# Altium schematic sheet Reconstruction_Filter.SchDoc
size B; Organization: Mechanart, LLC; Address1: 397 Laurie Meadows Drive; Address2: Apt. 437; Address3: San Mateo, CA 94403
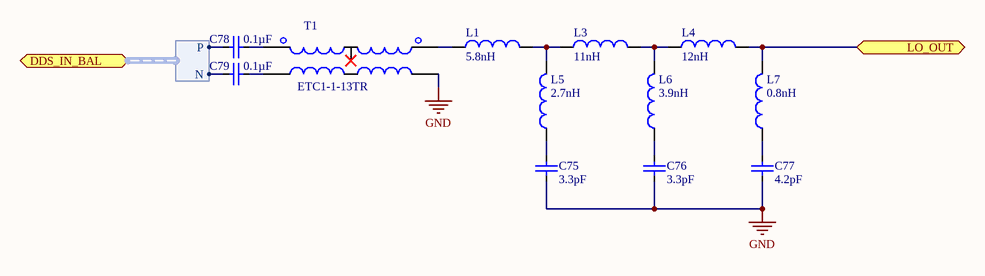
[diagram p0: Reconstruction_Filter.SchDoc]

## Parts
C75  3.3pF  [CAPC1005X50L25N]
C76  3.3pF  [CAPC1005X50L25N]
C77  4.2pF  [CAPC1005X50L25N]
C78  0.1µF  [CAPC1005X50L25N]
C79  0.1µF  [CAPC1005X50L25N]
L1  5.8nH  [INDC1006X18L23N]
L3  11nH  [INDC1006X18L23N]
L4  12nH  [INDC1006X18L23N]
L5  2.7nH  [INDC1006X18L23N]
L6  3.9nH  [INDC1006X18L23N]
L7  0.8nH  [INDC1006X18L23N]
T1  ETC1-1-13TR  [AT1521]

## Ports
DDS_IN_BAL (harness RF_BAL), LO_OUT

## Harnesses
RF_BAL: N, P

## Nets
GND: C75.2 C76.2 C77.2 T1.3(SECONDARY)
LO_OUT: L4.2 L7.2 ; port LO_OUT
NetC75_1: C75.1 L5.1
NetC76_1: C76.1 L6.1
NetC77_1: C77.1 L7.1
NetC78_1: C78.1 ; port DDS_IN_BAL.P
NetC78_2: C78.2 T1.6(PRIMARY_DOT)
NetC79_1: C79.1 ; port DDS_IN_BAL.N
NetC79_2: C79.2 T1.4(PRIMARY)
NetL1_1: L1.1 T1.1(SECONDARY_DOT)
NetL1_2: L1.2 L3.1 L5.2
NetL3_2: L3.2 L4.1 L6.2

Not connected (* = marked no-connect by the designer): T1 2(NO_CONNECT)*

## Notes on the sheet
- Title
- Size:
- Date:
- B
- Number:
- Time:
- Revision:
- Sheet
- of
- File:

## Library data of the parts
C75 C76 = GJM1555C1H3R3WB01D: CAP CER 3.3PF 50V NP0 0402; Manufacturer: Murata Electronics North America; Tolerance: ±0.05pF; Temperature Coefficient: C0G, NP0; Design Item Id: GJM1555C1H3R3WB01D; Supplier 1: Digi-Key; Supplier Part Number 1: 490-11212-1-ND; Manufacturer Part Number: GJM1555C1H3R3WB01D; RoHS: RoHS Compliant; Category: Capacitors; Stock 1: 7940; Pricing 1: 1=0.26, 10=0.216, 50=0.1216, 100=0.108, 250=0.081, 500=0.07156, 1000=0.06345, 5000=0.05265 (USD); Packaging: Cut Tape (CT); Applications: RF, Microwave, High Frequency; Operating Temperature: -55°C ~ 125°C; Mounting Type: Surface Mount, MLCC; Package / Case: 0402 (1005 Metric); ComponentLink1URL: http://www.murata.com/~/media/webrenewal/support/library/catalog/products/capacitor/mlcc/c02e.pdf; ComponentLink1Description: http://www.murata.com/~/media/webrenewal/support/library/catalog/products/capacitor/mlcc/c02e.pdf; Capacitance: 3.3pF; Voltage - Rated: 50V; Ratings: -; Size / Dimension: 0.039" L x 0.020" W (1.00mm x 0.50mm); Height - Seated (Max): -; Thickness (Max): 0.022" (0.55mm); Lead Spacing: -; Features: High Q, Low Loss; Lead Style: -
C77 = GJM1555C1H4R2BB01D: CAP CER 4.2PF 50V NP0 0402; Manufacturer: Murata Electronics North America; Tolerance: ±0.1pF; Temperature Coefficient: C0G, NP0; Design Item Id: GJM1555C1H4R2BB01D; Supplier 1: Digi-Key; Supplier Part Number 1: 490-11218-1-ND; Manufacturer Part Number: GJM1555C1H4R2BB01D; RoHS: RoHS Compliant; Category: Capacitors; Stock 1: 7288; Pricing 1: 1=0.2, 10=0.137, 50=0.0788, 100=0.0651, 250=0.0548, 500=0.0459, 1000=0.03768, 5000=0.03185 (USD); Packaging: Cut Tape (CT); Applications: RF, Microwave, High Frequency; Operating Temperature: -55°C ~ 125°C; Mounting Type: Surface Mount, MLCC; Package / Case: 0402 (1005 Metric); ComponentLink1URL: http://www.murata.com/~/media/webrenewal/support/library/catalog/products/capacitor/mlcc/c02e.pdf; ComponentLink1Description: http://www.murata.com/~/media/webrenewal/support/library/catalog/products/capacitor/mlcc/c02e.pdf; Capacitance: 4.2pF; Voltage - Rated: 50V; Ratings: -; Size / Dimension: 0.039" L x 0.020" W (1.00mm x 0.50mm); Height - Seated (Max): -; Thickness (Max): 0.022" (0.55mm); Lead Spacing: -; Features: High Q, Low Loss; Lead Style: -
C78 C79 = GRM155R71H104KE14D: CAP CER 0.1UF 50V X7R 0402; Manufacturer: Murata Electronics North America; Tolerance: ±10%; Design Item Id: GRM155R71H104KE14D; Supplier 1: Digi-Key; Supplier Part Number 1: 490-10700-1-ND; Manufacturer Part Number: GRM155R71H104KE14D; RoHS: RoHS Compliant; Category: Capacitors; Stock 1: 28600; Pricing 1: 1=0.1, 10=0.029, 50=0.0156, 100=0.0132, 250=0.0108, 500=0.00924, 1000=0.0072, 5000=0.006 (USD); Packaging: Cut Tape (CT); Applications: General Purpose; Operating Temperature: -55°C ~ 125°C; Mounting Type: Surface Mount, MLCC; Package / Case: 0402 (1005 Metric); ComponentLink1URL: http://www.murata.com/~/media/webrenewal/support/library/catalog/products/capacitor/mlcc/c02e.ashx; ComponentLink1Description: http://www.murata.com/~/media/webrenewal/support/library/catalog/products/capacitor/mlcc/c02e.ashx; Capacitance: 0.1µF; Voltage - Rated: 50V; Temperature Coefficient: X7R; Ratings: -; Size / Dimension: 0.039" L x 0.020" W (1.00mm x 0.50mm); Height - Seated (Max): -; Thickness (Max): 0.022" (0.55mm); Lead Spacing: -; Features: -; Lead Style: -
L1 = 04PA5N8: FIXED IND 5.8NH; Manufacturer: Coilcraft; Manufacturer Part Number: 0402PA-5N8XGLU; Type: Wirewound; Tolerance: ±2%; Design Item Id: 04PA5N8; Supplier 1: Coilcraft; Supplier Part Number 1: 0402PA-5N8XGLU; RoHS: RoHS Compliant; Category: Inductors, Coils, Chokes; Packaging: Cut Tape (CT); Package / Case: 0402 (1005 Metric); ComponentLink1URL: http://www.coilcraft.com/0402pa.cfm; Inductance: 5.8nH
L3 = 04CS11N: Design Item Id: 04CS11N; Supplier 1: Coilcraft; Inductance: 11nH
L4 = 04CS12N: Design Item Id: 04CS12N; Supplier 1: Coilcraft; Inductance: 12nH
L5 = 04HP2N7: Design Item Id: 04HP2N7; Supplier 1: Coilcraft; Inductance: 2.7nH
L6 = 04HP3N9: Design Item Id: 04HP3N9; Supplier 1: Coilcraft; Inductance: 3.9nH
L7 = 04PA0N8: Design Item Id: 04PA0N8; Supplier 1: Coilcraft; Inductance: 0.8nH
T1 = ETC1-1-13TR: TRANSFORMER; Manufacturer: M/A-Com Technology Solutions; Frequency Range: 4.5MHz ~ 3GHz; Impedance - Unbalanced/Balanced: 1:1; Insertion Loss (Max): 3.5dB; Design Item Id: ETC1-1-13TR; Supplier 1: Digi-Key; Supplier Part Number 1: 1465-1217-1-ND; Manufacturer Part Number: ETC1-1-13TR; RoHS: RoHS Compliant; Category: RF/IF and RFID; Stock 1: 14033; Pricing 1: 1=2.48, 10=1.98, 25=1.6088, 50=1.5676, 100=1.5263, 250=1.485, 500=1.47262, 1000=1.3035 (USD); Packaging: Cut Tape (CT); Mounting Type: Surface Mount; Package / Case: 5-SMD; ComponentLink1URL: http://cdn.macom.com/datasheets/ETC1-1-13.pdf; ComponentLink1Description: http://cdn.macom.com/datasheets/ETC1-1-13.pdf; Phase Difference: -; Return Loss (Min): -